# Altium schematic sheet bolid-power-input.SchDoc
size A3
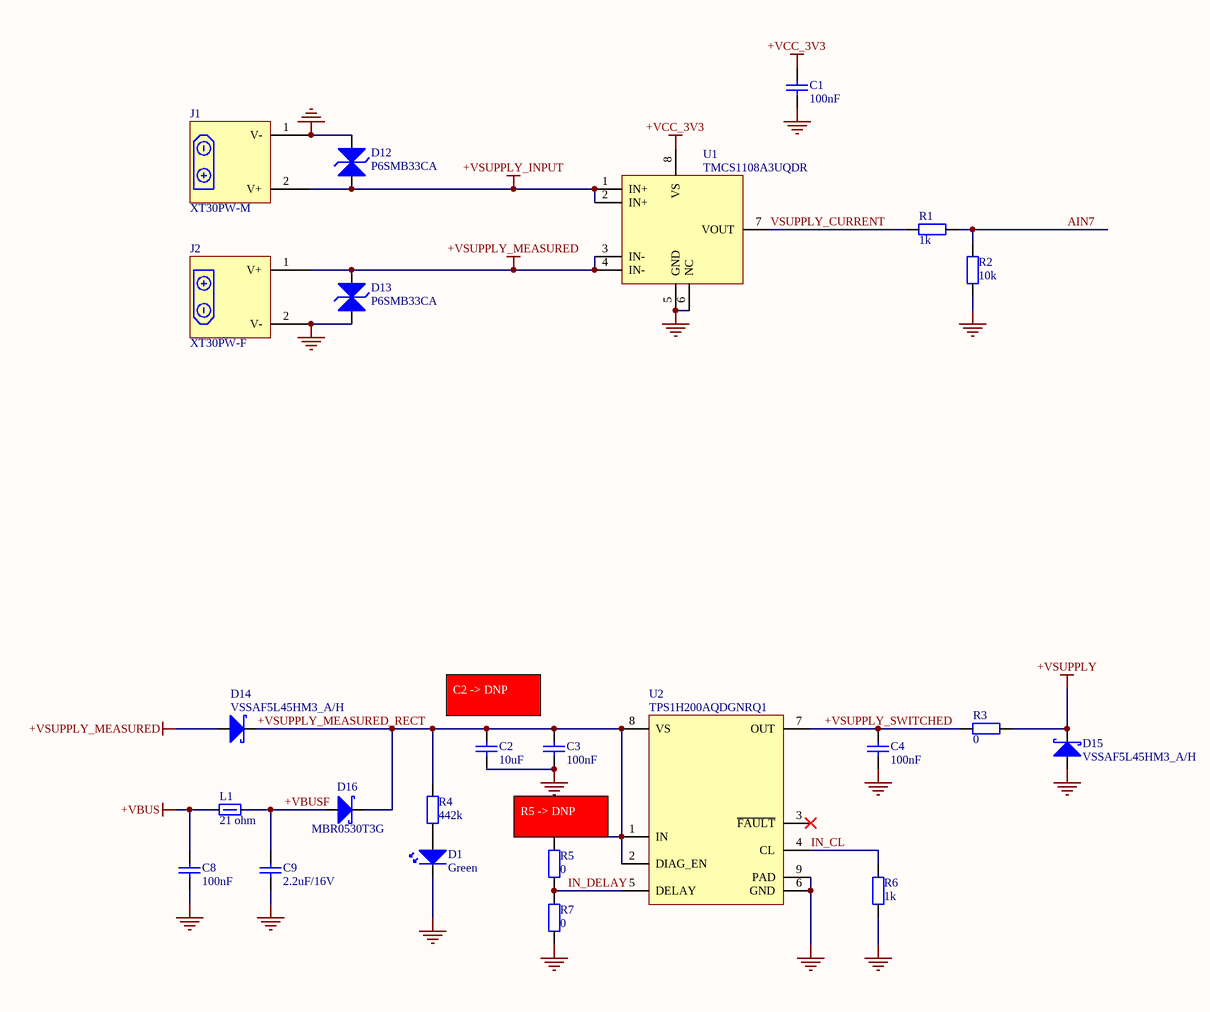
[diagram p0: bolid-power-input.SchDoc]

## Parts
C1  Value Displayed: 100nF  [C0402-CAPC100X50X55L22 - Tayio Yuden TDK]  (hidden comment: GRM155R71H104KE14D)
C2  Value Displayed: 10uF  [C1210-CAPC320X250X280L55N - Kemet]  (hidden comment: C1210C106K5RACTU)
C3  Value Displayed: 100nF  [C0402-CAPC100X50X55L22 - Tayio Yuden TDK]  (hidden comment: GRM155R71H104KE14D)
C4  Value Displayed: 100nF  [C0402-CAPC100X50X55L22 - Tayio Yuden TDK]  (hidden comment: GRM155R71H104KE14D)
C8  Value Displayed: 100nF  [C0402-CAPC100X50X55L22 - Tayio Yuden TDK]  (hidden comment: GRM155R71H104KE14D)
C9  Value Displayed: 2.2uF/16V  [C0603-CAPC162X80X95L35N]  (hidden comment: EMK107BB7225MA-T)
D1  Illumination Color: Green  [D0603 DIONC166X84X36L42N Littelfuse]  (hidden comment: 150060GS75000)
D12  P6SMB33CA  [DO-214AA SMB BIPOLAR DIOM540X362X261L115X205N - Littlefuse]
D13  P6SMB33CA  [DO-214AA SMB BIPOLAR DIOM540X362X261L115X205N - Littlefuse]
D14  VSSAF5L45HM3_A/H  [DO-221AC SlimSMA SODFL520X260X100L97X135N - Vishay]
D15  VSSAF5L45HM3_A/H  [DO-221AC SlimSMA SODFL520X260X100L97X135N - Vishay]
D16  MBR0530T3G  [SOD-123-2L SOD375X160X128L32X60N - Fairchild]
J1  XT30PW-M  [AMASS XT30PW-M]
J2  XT30PW-F  [AMASS XT30PW-F]
L1  value 21 ohm  [FB0805 - BEADC205X125X145L50N]  (hidden comment: FBMJ2125HM210NT)
R1  value 1k  [R0402-RESC100X50X40L22N]  (hidden comment: RC0402FR-071KL)
R2  value 10k  [R0402-RESC100X50X40L22N]  (hidden comment: RC0402FR-0710KL)
R3  value 0  [R1206-RESC307X157X65L40N]  (hidden comment: AC1206JR-130RL)
R4  value 442k  [R0402-RESC100X50X40L22N]  (hidden comment: ERJ-2RKF4423X)
R5  value 0  [R0402-RESC100X50X40L22N]  (hidden comment: RC0402JR-7D0RL)
R6  value 1k  [R0402-RESC100X50X40L22N]  (hidden comment: RC0402FR-071KL)
R7  value 0  [R0402-RESC100X50X40L22N]  (hidden comment: RC0402JR-7D0RL)
U1  TMCS1108A3UQDR  [TI SOIC8 D0008B SOIC127P600X175-8N]
U2  TPS1H200AQDGNRQ1  [TI VSSOP8 DGN0008G TSOP65P490X110_HS-9N]

## Nets
+VBUS: C8.2 L1.1
+VCC_3V3: C1.2 U1.8(VS)
+VSUPPLY: D15.1(K) R3.2
+VSUPPLY_INPUT: D12.1 J1.2(V+) U1.1(IN+) U1.2(IN+)
+VSUPPLY_MEASURED: D13.2 D14.2(A) J2.1(V+) U1.3(IN-) U1.4(IN-)
GND: C1.1 C2.1 C3.1 C4.1 C8.1 C9.1 D1.1(K) D12.2 D13.1 D15.2(A) J1.1(V-) J2.2(V-) R2.1 R6.1 R7.2 U1.5(GND) U1.6(NC) U2.6(GND) U2.9(PAD)
+VBUSF: C9.2 D16.2(A) L1.2
+VSUPPLY_MEASURED_RECT: C2.2 C3.2 D14.1(K) D16.1(K) R4.2 R5.1 U2.1(IN) U2.2(DIAG_EN) U2.8(VS)
+VSUPPLY_SWITCHED: C4.2 R3.1 U2.7(OUT)
AIN7: R1.1 R2.2
IN_CL: R6.2 U2.4(CL)
IN_DELAY: R5.2 R7.1 U2.5(DELAY)
VSUPPLY_CURRENT: R1.2 U1.7(VOUT)
NetD1_2: D1.2(A) R4.1

Not connected (* = marked no-connect by the designer): U2 3(~{FAULT})*

## Notes on the sheet
- C2 -> DNP
- (near R5) R5 -> DNP

## Library data of the parts
C1 C3 C4 C8 = GRM155R71H104KE14D: MLCC 0402 (1005) 100nF 10% 50V X7R; Manufacturer: Murata Electronics; Capacitance: 0.1 uF; Type: Chip Multilayer Ceramic Capacitor for General Purpose; Voltage Rating DC: 50 VDC; Capacitance - pF: 100000 pF; Class: Class 2; Supplier 1: Mouser; Manufacturer Part Number: GRM155R71H104KE14D; RoHS: RoHS Compliant; Category: Multilayer Ceramic Capacitors MLCC - SMD/SMT; Stock 1: 3511637; Pricing 1: 1=0.090, 10=0.038, 100=0.016, 500=0.012, 1000=0.009, 2500=0.008, 5000=0.007, 10000=0.005 (EUR); Height: 0.5 mm; Length: 1 mm; Package / Case: 0402 (1005 metric); Packaging: Cut Tape; Product: General Type MLCCs; Series: GRM; Termination Style: SMD/SMT; Tolerance: 10 %; Width: 0.5 mm; Brand: Murata Electronics; Capacitance - nF: 100 nF; Case Code - in: 0402; Case Code - mm: 1005; Dielectric: X7R; Maximum Operating Temperature: + 125 C; Minimum Operating Temperature: - 55 C; Product Type: Ceramic Capacitors; Standard Pack Qty: 10000; Subcategory: Capacitors; Termination: Standard; RoHS - Mouser: Y; Minimum Order Quantity: 1; Reeling: True; ComponentLink1URL: https://www.mouser.com/datasheet/2/281/murata_03052018_GRM_Series_1-1310166.pdf; ComponentLink1Description: https://www.mouser.com/datasheet/2/281/murata_03052018_GRM_Series_1-1310166.pdf; Value: 100nF; Supplier Part Number 1: 81-GRM155R71H104KE4D
C2 = C1210C106K5RACTU: MLCC 1210 (3225) 10uF 10% 50V X7R; Manufacturer: KEMET; Voltage Rating DC: 50 VDC; Class: Class 2; Supplier 1: Mouser; Manufacturer Part Number: C1210C106K5RACTU; RoHS: RoHS Compliant; Category: Multilayer Ceramic Capacitors MLCC - SMD/SMT; Stock 1: 1149; Pricing 1: 1=0.984, 10=0.728, 100=0.498, 500=0.394, 1000=0.296 (USD); Capacitance: 10 uF; Height: 2.5 mm; Length: 3.2 mm; Package / Case: 1210 (3225 metric); Packaging: Cut Tape; Product: General Type MLCCs; Series: SMD Comm X7R; Termination Style: SMD/SMT; Tolerance: 10 %; Voltage Rating AC: -; Width: 2.5 mm; Brand: KEMET; Case Code - in: 1210; Case Code - mm: 3225; Dielectric: X7R; Maximum Operating Temperature: + 125 C; Minimum Operating Temperature: - 55 C; Product Type: Ceramic Capacitors; Standard Pack Qty: 1000; Subcategory: Capacitors; Termination: Standard; RoHS - Mouser: Y; Minimum Order Quantity: 1; Reeling: True; ComponentLink1URL: https://www.mouser.com/datasheet/2/212/KEM_C1002_X7R_SMD-1102033.pdf; ComponentLink1Description: https://www.mouser.com/datasheet/2/212/KEM_C1002_X7R_SMD-1102033.pdf; Supplier Part Number 1: 80-C1210C106K5R; Value: 10uF
C9 = EMK107BB7225MA-T: MLCC 0603 (1608) 2.2uF 20% 16V X7R; Manufacturer: Taiyo Yuden; Type: AECStandardQ200; Voltage Rating DC: 16 VDC; Capacitance - nF: 2200 nF; Value: 2.2u; Supplier 1: Mouser; Manufacturer Part Number: EMK107BB7225MA-T; RoHS: RoHS Compliant; Category: Multilayer Ceramic Capacitors MLCC - SMD/SMT; Stock 1: 5687; Pricing 1: 1=0.324, 10=0.228, 100=0.129, 500=0.090, 1000=0.078, 4000=0.060, 8000=0.057, 12000=0.055, 24000=0.048 (EUR); Capacitance: 2.2 uF; Height: 0.8 mm; Length: 1.6 mm; Package / Case: 0603 (1608 metric); Packaging: Cut Tape; Product: Automotive MLCCs; Series: M; Termination Style: SMD/SMT; Tolerance: 20 %; Width: 0.8 mm; Brand: Taiyo Yuden; Case Code - in: 0603; Case Code - mm: 1608; Dielectric: X7R; Maximum Operating Temperature: + 125 C; Minimum Operating Temperature: - 55 C; Product Type: Ceramic Capacitors; Standard Pack Qty: 4000; Subcategory: Capacitors; Termination: Standard; RoHS - Mouser: Y; Minimum Order Quantity: 1; Reeling: True; ComponentLink1URL: https://www.mouser.com/datasheet/2/396/mlcc02_e-1307760.pdf; ComponentLink1Description: https://www.mouser.com/datasheet/2/396/mlcc02_e-1307760.pdf; Supplier Part Number 1: 963-EMK107BB7225MA-T
D1 = 150060GS75000: LED 0603 (1608) Green; Manufacturer: Wurth Elektronik; Lens Color/Style: Water Clear; Power Rating: 105 mW; Lens Shape: Rectangular; Luminous Intensity: 430 mcd; Peak Wavelength: 515 nm; Viewing Angle: 140 deg; If - Forward Current: 20 mA; Vf - Forward Voltage: 3.2 V; Vr - Reverse Voltage: 5 V; Wavelength/Color Temperature: 520 nm; Supplier 1: Mouser; Manufacturer Part Number: 150060GS75000; RoHS: RoHS Compliant; Category: Standard LEDs - SMD; Stock 1: 17312; Pricing 1: 1=0.130, 10=0.126, 50=0.115, 100=0.099, 500=0.085, 4000=0.085 (EUR); Height: 0.7 mm; Length: 1.6 mm; Package / Case: 0603 (1608 metric); Packaging: Cut Tape; Product: Green LEDs; Series: WL-SMCW; Width: 0.8 mm; Brand: Wurth Elektronik; Mounting Style: SMD/SMT; Lens Dimensions: 1.1 mm x 0.8 mm; Lens Transparency: Water Clear; Maximum Operating Temperature: + 85 C; Minimum Operating Temperature: - 40 C; Moisture Sensitive: Yes; Product Type: LED - Standard; Standard Pack Qty: 4000; Subcategory: LEDs; RoHS - Mouser: Y; Minimum Order Quantity: 1; Reeling: True; ComponentLink1URL: https://www.mouser.com/datasheet/2/445/150060GS75000-368921.pdf; ComponentLink1Description: https://www.mouser.com/datasheet/2/445/150060GS75000-368921.pdf; Supplier Part Number 1: 710-150060GS75000
D12 D13 = P6SMB33CA: TVS DIODE 28.2VWM 45.7VC SMD; Manufacturer: Littelfuse; Supplier 1: Mouser; Manufacturer Part Number: P6SMB33CA; RoHS: Yes; Category: TVS Diodes; Stock 1: 8269; Pricing 1: 1=0,4, 10=0,271, 50=0,271, 100=0,143, 1000=0,129, 10000=0,09 (USD); ComponentLink1URL: https://datasheet.ciiva.com/15143/getdatasheetpartid-185168-15143889.pdf?src-supplier=Verical; ComponentLink1Description: https://datasheet.ciiva.com/15143/getdatasheetpartid-185168-15143889.pdf?src-supplier=Verical; ComponentLink2URL: https://datasheet.ciiva.com/18551/littelfuse-tvs-diode-p6smb-datasheet-pdf-18551222.pdf?src-supplier=Digikey; ComponentLink2Description: https://datasheet.ciiva.com/18551/littelfuse-tvs-diode-p6smb-datasheet-pdf-18551222.pdf?src-supplier=Digikey; ComponentLink3URL: https://datasheet.ciiva.com/331/littelfuse-tvs-diode-p6smb-datasheet-pdf-331631.pdf?src-supplier=Digikey; ComponentLink3Description: https://datasheet.ciiva.com/331/littelfuse-tvs-diode-p6smb-datasheet-pdf-331631.pdf?src-supplier=Digikey; ComponentLink4URL: https://datasheet.ciiva.com/331/littelfuse-tvs-diode-p6smb-datasheet-pdf-331632.pdf?src-supplier=Digikey; ComponentLink4Description: https://datasheet.ciiva.com/331/littelfuse-tvs-diode-p6smb-datasheet-pdf-331632.pdf?src-supplier=Digikey; ComponentLink5URL: https://datasheet.ciiva.com/331/littelfuse-tvs-diode-p6smb-datasheet-pdf-331633.pdf?src-supplier=Digikey; ComponentLink5Description: https://datasheet.ciiva.com/331/littelfuse-tvs-diode-p6smb-datasheet-pdf-331633.pdf?src-supplier=Digikey; Supplier Part Number 1: 576-P6SMB33CA
D14 D15 = VSSAF5L45HM3_A/H: Schottky Rectifier Diode, 5A, Do-221Ac-2 Rohs Compliant: Yes |Vishay VSSAF5L45HM3_A/H; Manufacturer: Vishay; Supplier 1: Mouser; Manufacturer Part Number: VSSAF5L45HM3_A/H; RoHS: No; Category: Rectifier Diodes; Stock 1: 4251; Pricing 1: 1=0,45, 10=0,303, 50=0,303, 100=0,205, 1000=0,142, 10000=0,115 (USD); RoHS Compliant: Yes; Supplier Part Number 1: 78-VSSAF5L45HM3_A/H
D16 = MBR0530T3G: ON Semi MBR0530T3G; SMT Schottky Diode; 30V 500mA; 2-Pin SOD-123; Manufacturer: ON Semiconductor; Supplier 1: Mouser; Manufacturer Part Number: MBR0530T3G; RoHS: Yes; Category: Schottky Diodes; Stock 1: 167531; Pricing 1: 1=0,19, 10=0,126, 50=0,126, 100=0,065, 1000=0,053, 10000=0,041 (USD); ComponentLink1URL: https://datasheet.ciiva.com/6381/mbr0530t1-d-6381904.pdf?src-supplier=Digikey; ComponentLink1Description: https://datasheet.ciiva.com/6381/mbr0530t1-d-6381904.pdf?src-supplier=Digikey; ComponentLink2URL: https://datasheet.ciiva.com/7962/85890-7962703.pdf?src-supplier=Element14; ComponentLink2Description: https://datasheet.ciiva.com/7962/85890-7962703.pdf?src-supplier=Element14; ComponentLink3URL: https://datasheet.ciiva.com/8294/mbr0530t1-d-8294572.pdf?src-supplier=Avnet; ComponentLink3Description: https://datasheet.ciiva.com/8294/mbr0530t1-d-8294572.pdf?src-supplier=Avnet; ComponentLink4URL: https://datasheet.ciiva.com/15144/getdatasheetpartid-86762-15144599.pdf?src-supplier=Verical; ComponentLink4Description: https://datasheet.ciiva.com/15144/getdatasheetpartid-86762-15144599.pdf?src-supplier=Verical; ComponentLink5URL: https://datasheet.ciiva.com/6381/mbr0530t1-d-6381902.pdf?src-supplier=Digikey; ComponentLink5Description: https://datasheet.ciiva.com/6381/mbr0530t1-d-6381902.pdf?src-supplier=Digikey; Supplier Part Number 1: 863-MBR0530T3G
L1 = FBMJ2125HM210NT: Ferrite Beads Power Chip 21Ohm 30% 100MHz 6A 0.004Ohm DCR 0805 Automotive T/R; Manufacturer: Taiyo Yuden; Impedance: 21R; Number of Lines: 1; DC Resistance (DCR): 4mR; Shielding: Unshielded; Supplier 1: Mouser; Manufacturer Part Number: FBMJ2125HM210NT; RoHS: Yes; Category: Ferrite Beads and Chips; Stock 1: 123431; Pricing 1: 1=0,12000, 10=0,06400, 50=0,06400, 100=0,04400, 1000=0,03300, 10000=0,03100 (USD); Mount: Surface Mount; Case/Package: 0805; Number of Pins: 2; Core Material: Ferrite; Case Code (Metric): 2012; Case Code (Imperial): 0805; Material: Ferrite; Min Operating Temperature: -40°C; Max Operating Temperature: 125°C; Package Quantity: 1; Packaging: Tape and Reel; Tolerance: 30%; Max Current Rating: 6A; Max DC Current: 6A; Termination: SMD/SMT; Test Frequency: 100MHz; Frequency: 100MHz; Resistor Type: Ferrite Bead; Length: 2mm; Width: 0.049inch; Height: 0.85mm; Depth: 1.45mm; REACH SVHC: Unknown; Lead Free: Lead Free; Halogen Free: Halogen Free; ComponentLink1URL: https://datasheet.ciiva.com/6212/fbmj2125hm210nt-ss-6212912.pdf?src-supplier=Digi-Key; ComponentLink1Description: https://datasheet.ciiva.com/6212/fbmj2125hm210nt-ss-6212912.pdf?src-supplier=Digi-Key; ComponentLink2URL: https://datasheet.ciiva.com/25614/0900766b810b37be-25614411.pdf?src-supplier=RSComponents; ComponentLink2Description: https://datasheet.ciiva.com/25614/0900766b810b37be-25614411.pdf?src-supplier=RSComponents; ComponentLink3URL: https://datasheet.ciiva.com/6212/chipbeads01-e-6212907.pdf?src-supplier=Digi-Key; ComponentLink3Description: https://datasheet.ciiva.com/6212/chipbeads01-e-6212907.pdf?src-supplier=Digi-Key; ComponentLink4URL: https://datasheet.ciiva.com/6212/chipbeads01-e-6212908.pdf?src-supplier=Digi-Key; ComponentLink4Description: https://datasheet.ciiva.com/6212/chipbeads01-e-6212908.pdf?src-supplier=Digi-Key; Supplier Part Number 1: 963-FBMJ2125HM210NT
R1 R6 = RC0402FR-071KL: RES 0402 (1005) 1.00k 1% 0.0625W 50V Thick Film; Manufacturer: Yageo; Power Rating: 62.5 mW, 125 mW; Resistance: 1 kOhms; Temperature Coefficient: 100 PPM / C; Supplier 1: Mouser; Manufacturer Part Number: RC0402FR-071KL; RoHS: RoHS Compliant; Category: Thick Film Resistors - SMD; Stock 1: 18776448; Pricing 1: 1=0.090, 10=0.011, 100=0.004, 1000=0.003, 10000=0.003 (EUR); Application: High Reliability; Features: -; Height: 0.35 mm; Length: 1 mm; Package / Case: -; Packaging: Cut Tape; Product: Thick Film Resistors SMD; Series: RC; Technology: Thick Film; Termination Style: SMD/SMT; Tolerance: 1 %; Type: General Purpose; Voltage Rating: 50 V; Width: 0.5 mm; Brand: Yageo; Mounting Style: PCB Mount; Case Code - in: 0402; Case Code - mm: 1005; Maximum Operating Temperature: + 155 C; Minimum Operating Temperature: - 55 C; Product Type: Thick Film Resistors; Standard Pack Qty: 10000; Subcategory: Resistors; RoHS - Mouser: Y; Minimum Order Quantity: 1; Reeling: True; ComponentLink1URL: https://www.mouser.com/datasheet/2/447/PYu-RC_Group_51_RoHS_L_10-1664068.pdf; ComponentLink1Description: https://www.mouser.com/datasheet/2/447/PYu-RC_Group_51_RoHS_L_10-1664068.pdf; Supplier Part Number 1: 603-RC0402FR-071KL
R2 = RC0402FR-0710KL: RES 0402 (1005) 10.0k 1% 0.0625W 50V Thick Film; Manufacturer: Yageo; Power Rating: 62.5 mW, 125 mW; Resistance: 10 kOhms; Temperature Coefficient: 100 PPM / C; Supplier 1: Mouser; Manufacturer Part Number: RC0402FR-0710KL; RoHS: RoHS Compliant; Category: Thick Film Resistors - SMD; Stock 1: 20942447; Pricing 1: 1=0.090, 10=0.011, 100=0.004, 1000=0.003, 10000=0.003 (EUR); Application: High Reliability; Features: -; Height: 0.35 mm; Length: 1 mm; Package / Case: -; Packaging: Cut Tape; Product: Thick Film Resistors SMD; Series: RC; Technology: Thick Film; Termination Style: SMD/SMT; Tolerance: 1 %; Type: General Purpose; Voltage Rating: 50 V; Width: 0.5 mm; Brand: Yageo; Mounting Style: PCB Mount; Case Code - in: 0402; Case Code - mm: 1005; Maximum Operating Temperature: + 155 C; Minimum Operating Temperature: - 55 C; Product Type: Thick Film Resistors; Standard Pack Qty: 10000; Subcategory: Resistors; RoHS - Mouser: Y; Minimum Order Quantity: 1; Reeling: True; ComponentLink1URL: https://www.mouser.com/datasheet/2/447/PYu-RC_Group_51_RoHS_L_10-1664068.pdf; ComponentLink1Description: https://www.mouser.com/datasheet/2/447/PYu-RC_Group_51_RoHS_L_10-1664068.pdf; Supplier Part Number 1: 603-RC0402FR-0710KL
R3 = AC1206JR-130RL: RES 1206 (3216) 0.00 ohm 1% 0.250W Thick Film; Manufacturer: Yageo; Resistance: 0R; Tolerance: 5%; Supplier 1: Mouser; Manufacturer Part Number: AC1206JR-130RL; RoHS: Yes; Category: Chip SMD Resistors; Stock 1: 52073; Pricing 1: 1=0,1, 10=0,028, 50=0,028, 100=0,02, 1000=0,013, 10000=0,007 (USD); Case/Package: 1206; Min Operating Temperature: -55°C; Max Operating Temperature: 155°C; Packaging: Tape and Reel; Resistor Type: Thick Film; Length: 3.1mm; Depth: 1.6mm; Military Standard: Not; Lead Free: Lead Free; RoHS Compliant: Yes; ComponentLink1URL: https://datasheet.octopart.com/AC1206JR-130RL-Yageo-datasheet-151884373.pdf?src-supplier=Future+Electronics; ComponentLink1Description: https://datasheet.octopart.com/AC1206JR-130RL-Yageo-datasheet-151884373.pdf?src-supplier=Future+Electronics; Supplier Part Number 1: 603-AC1206JR-130RL
R4 = ERJ-2RKF4423X: RES 0402 (1005) 442.0k 1% 0.100W 50V Thick Film; Manufacturer: Panasonic; Power Rating: 100 mW (1/10 W); Resistance: 442 kOhms; Temperature Coefficient: 100 PPM / C; Qualification: AEC-Q200; Supplier 1: Mouser; Manufacturer Part Number: ERJ-2RKF4423X; RoHS: RoHS Compliant By Exemption; Category: Thick Film Resistors - SMD; Stock 1: 56067; Pricing 1: 1=0.085, 10=0.025, 100=0.010, 1000=0.005, 2500=0.004, 5000=0.003, 10000=0.003 (EUR); Application: Automotive Grade; Features: Precision Resistors; Height: 0.35 mm; Length: 1 mm; Packaging: Cut Tape; Product: Thick Film Resistors SMD; Series: ERJ-2Rx; Technology: Thick Film; Termination Style: SMD/SMT; Tolerance: 1 %; Voltage Rating: 50 V; Width: 0.5 mm; Brand: Panasonic; Mounting Style: PCB Mount; Case Code - in: 0402; Case Code - mm: 1005; Maximum Operating Temperature: + 155 C; Minimum Operating Temperature: - 55 C; Product Type: Thick Film Resistors; Standard Pack Qty: 10000; Subcategory: Resistors; RoHS - Mouser: E; Minimum Order Quantity: 1; Reeling: True; ComponentLink1URL: https://www.mouser.com/datasheet/2/315/AOA0000C304-1149620.pdf; ComponentLink1Description: https://www.mouser.com/datasheet/2/315/AOA0000C304-1149620.pdf; Supplier Part Number 1: 667-ERJ-2RKF4423X
R5 R7 = RC0402JR-7D0RL: RES 0402 (1005) 0.00 ohm 1% 0.0625W 50V Thick Film; Manufacturer: Yageo; Resistance: 0mR; Tolerance: 5%; Supplier 1: Mouser; Manufacturer Part Number: RC0402JR-7D0RL; RoHS: Yes; Category: Chip SMD Resistors; Stock 1: 114874; Pricing 1: 1=0,10000, 10=0,01400, 50=0,01400, 100=0,00600, 1000=0,00300, 10000=0,00200 (USD); Case/Package: 0402; RoHS Compliant: Yes; Supplier Part Number 1: 603-RC0402JR-7D0RL
U1 = TMCS1108A3UQDR: 100-V Hall-effect current sensor with internal reference 8-SOIC -40 to 85; Manufacturer: Texas Instruments; Supplier 1: Mouser; Manufacturer Part Number: TMCS1108A3UQDR; RoHS: No; Category: Integrated Circuits (ICs); Stock 1: 2771; Pricing 1: 1=2,3, 10=1,8, 50=1,8, 100=1,41, 1000=1,09, 10000=0,876 (USD); Supplier Part Number 1: 595-TMCS1108A3UQDR
U2 = TPS1H200AQDGNRQ1: Power switch IC-Power distribution: 3.4-40V; -40+125 st.C; SMD; MSOP-PowerPad-8; AEC-Q100; Manufacturer: Texas Instruments; Max Supply Voltage: 40V; Min Supply Voltage: 4V; Nominal Supply Current: 5mA; Number of Drivers: 1NUMBER; Output Current: 2.5A; Output Voltage: 42V; Turn-Off Delay Time: 50us; Supplier 1: Mouser; Manufacturer Part Number: TPS1H200AQDGNRQ1; RoHS: Yes; Category: Gate Drivers; Stock 1: 31179; Pricing 1: 1=1,52, 10=1,29, 50=1,29, 100=0,988, 1000=0,689, 10000=0,587 (USD); Number of Pins: 8NUMBER; Turn-On Delay Time: 50us; Length: 3mm; Width: 3mm; Height: 1.1mm; Thickness: 1.02mm; ComponentLink1URL: http://www.ti.com/general/docs/suppproductinfo.tsp?distId=10&amp;gotoUrl=http%3A%2F%2Fwww.ti.com%2Flit%2Fgpn%2Ftps1h200a-q1&src-supplier=Digikey; ComponentLink1Description: http://www.ti.com/general/docs/suppproductinfo.tsp?distId=10&amp;gotoUrl=http%3A%2F%2Fwww.ti.com%2Flit%2Fgpn%2Ftps1h200a-q1&src-supplier=Digikey; ComponentLink2URL: http://www.ti.com/lit/ds/symlink/tps1h200a-q1.pdf?src-supplier=Digikey; ComponentLink2Description: http://www.ti.com/lit/ds/symlink/tps1h200a-q1.pdf?src-supplier=Digikey; Supplier Part Number 1: 595-TPS1H200AQDGNRQ1
J1 = XT30PW-M: ComponentLink1Description: TME; ComponentLink1URL: https://www.tme.eu/pl/details/xt30pw-m/zlacza-dc/amass/
J2 = XT30PW-F: ComponentLink1Description: TME; ComponentLink1URL: https://www.tme.eu/pl/details/xt30pw-f/zlacza-dc/amass/